# Altium schematic sheet USB.SchDoc
size A4; SheetNumber: 7; SheetTotal: 15
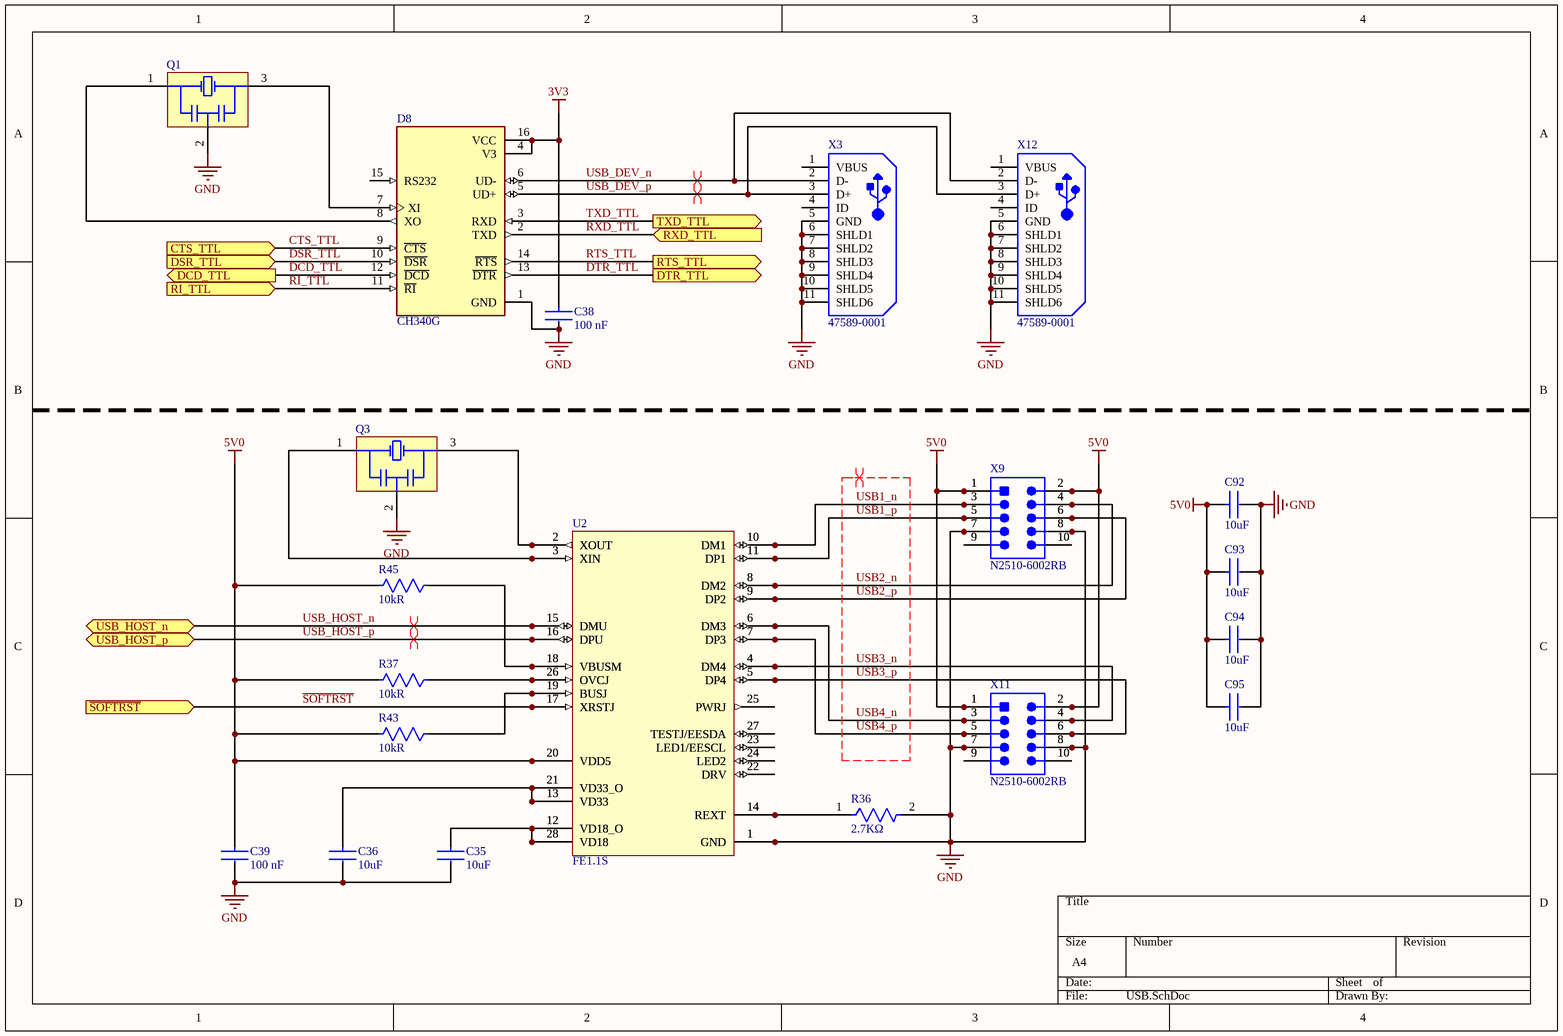
[diagram p0: USB.SchDoc]

## Parts
C35  Capacitance: 10uF  [FP-C0805C-DG-IPC_A]  (hidden comment: C0805C106K8PACTU)
C36  Capacitance: 10uF  [FP-C0805C-DG-IPC_A]  (hidden comment: C0805C106K8PACTU)
C38  Capacitance: 100 nF  [FP-CC0805-0_85-IPC_A]  (hidden comment: CC0805KRX7R9BB104)
C39  Capacitance: 100 nF  [FP-CC0805-0_85-IPC_A]  (hidden comment: CC0805KRX7R9BB104)
C92  Capacitance: 10uF  [FP-C0805C-DG-IPC_A]  (hidden comment: C0805C106K8PACTU)
C93  Capacitance: 10uF  [FP-C0805C-DG-IPC_A]  (hidden comment: C0805C106K8PACTU)
C94  Capacitance: 10uF  [FP-C0805C-DG-IPC_A]  (hidden comment: C0805C106K8PACTU)
C95  Capacitance: 10uF  [FP-C0805C-DG-IPC_A]  (hidden comment: C0805C106K8PACTU)
D8  CH340G  [SOIC127P600X180-16N]
Q1  CSTCE12M0G55Z-R0  [MURA-CSTCE_G_V]  (value not drawn)
Q3  CSTCE12M0G55Z-R0  [MURA-CSTCE_G_V]  (value not drawn)
R36  Resistance: 2.7KΩ  [FP-AC0805-IPC_A]  (hidden comment: AC0805FR-072K7L)
R37  Resistance: 10kR  [FP-CR0805-IPC_A]  (hidden comment: CR0805-JW-103ELF)
R43  Resistance: 10kR  [FP-CR0805-IPC_A]  (hidden comment: CR0805-JW-103ELF)
R45  Resistance: 10kR  [FP-CR0805-IPC_A]  (hidden comment: CR0805-JW-103ELF)
U2  FE1.1S  [TSOP64P600X160-28L]
X3  47589-0001  [MOLX-47589-0001_V]
X9  N2510-6002RB  [3M-N2510-6002-10_V]
X11  N2510-6002RB  [3M-N2510-6002-10_V]
X12  47589-0001  [MOLX-47589-0001_V]

## Ports
CTS_TTL (in), DCD_TTL (out), DSR_TTL (in), DTR_TTL (out), RI_TTL (in), RTS_TTL (out), RXD_TTL (in), TXD_TTL (out), USB_HOST_n (bidir), USB_HOST_p (bidir), ~{SOFTRST} (in)

## Nets
3V3: C38.1 D8.4(V3) D8.16(VCC)
5V0: C39.1 C92.1 C93.1 C94.1 C95.1 R37.2 R43.2 R45.2 U2.20(VDD5) X9.1 X9.2 X11.1 X11.2
GND: C35.2 C36.2 C38.2 C39.2 C92.2 C93.2 C94.2 C95.2 D8.1(GND) Q1.2(GND) Q3.2(GND) R36.2 U2.1(GND) X3.5(GND) X3.6(SHLD1) X3.7(SHLD2) X3.8(SHLD3) X3.9(SHLD4) X3.10(SHLD5) X3.11(SHLD6) X9.7 X9.8 X11.7 X11.8 X12.5(GND) X12.6(SHLD1) X12.7(SHLD2) X12.8(SHLD3) X12.9(SHLD4) X12.10(SHLD5) X12.11(SHLD6)
CTS_TTL: D8.9(~{CTS}) ; port CTS_TTL
DCD_TTL: D8.12(~{DCD}) ; port DCD_TTL
DSR_TTL: D8.10(~{DSR}) ; port DSR_TTL
DTR_TTL: D8.13(~{DTR}) ; port DTR_TTL
RI_TTL: D8.11(~{RI}) ; port RI_TTL
RTS_TTL: D8.14(~{RTS}) ; port RTS_TTL
RXD_TTL: D8.2(TXD) ; port RXD_TTL
~{SOFTRST}: U2.17(XRSTJ) ; port ~{SOFTRST}
TXD_TTL: D8.3(RXD) ; port TXD_TTL
USB1_n: U2.10(DM1) X9.3
USB1_p: U2.11(DP1) X9.5
USB2_n: U2.8(DM2) X9.4
USB2_p: U2.9(DP2) X9.6
USB3_n: U2.4(DM4) X11.4
USB3_p: U2.5(DP4) X11.6
USB4_n: U2.6(DM3) X11.3
USB4_p: U2.7(DP3) X11.5
USB_DEV_n: D8.6(UD-) X3.2(D-) X12.2(D-)
USB_DEV_p: D8.5(UD+) X3.3(D+) X12.3(D+)
USB_HOST_n: U2.15(DMU) ; port USB_HOST_n
USB_HOST_p: U2.16(DPU) ; port USB_HOST_p
NetC35_1: C35.1 U2.12(VD18_O) U2.28(VD18)
NetC36_1: C36.1 U2.13(VD33) U2.21(VD33_O)
NetD8_7: D8.7(XI) Q1.3(X2)
NetD8_8: D8.8(XO) Q1.1(X1)
NetQ3_1: Q3.1(X1) U2.3(XIN)
NetQ3_3: Q3.3(X2) U2.2(XOUT)
NetR36_1: R36.1 U2.14(REXT)
NetR37_1: R37.1 U2.26(OVCJ)
NetR43_1: R43.1 U2.19(BUSJ)
NetR45_1: R45.1 U2.18(VBUSM)

Not connected (* = marked no-connect by the designer): D8 15(RS232); U2 22(DRV) 23(LED1/EESCL) 24(LED2) 25(PWRJ) 27(TESTJ/EESDA); X3 1(VBUS) 4(ID); X9 9 10; X11 9 10; X12 1(VBUS) 4(ID)

## Layout directives
differential pair: USB1_n, USB1_p, USB2_n, USB2_p, USB3_n, USB3_p, USB4_n, USB4_p, USB_DEV_n, USB_DEV_p, USB_HOST_n, USB_HOST_p

## Library data of the parts
C35 C36 C92-C95 = CMP-2007-03243-2: CAP CER 10UF 10V X5R 0805; Manufacturer: KEMET; Manufacturer Part Number: C0805C106K8PACTU; Value: 10uF; Category: Cap; Case/Package: 0805
C38 C39 = CMP-2100-03606-3: CAP CER 0.1UF 50V X7R 0805; Manufacturer: Yageo; Value: 100 nF; Category: Cap; Manufacturer Part Number: CC0805KRX7R9BB104; Case/Package: 0805
D8 = CH340G: USB Interface Integrated Circuit; Value: CH340G; Case/Package: SOIC-16; Category: IC
Q1 Q3 = CMP-2000-06123-1: Ceramic Resonator, 12 MHz, +/- 0.5%, -40 to 125 degC, 3-Pin SMD, RoHS, Tape and Reel; Manufacturer: Murata; Capacitance: 33pF; Category: CrystalsandOscillators; Manufacturer Part Number: CSTCE12M0G55Z-R0; value: CSTCE12M0G55Z-R0
R36 = CMP-2001-04496-2: RES SMD 2.7K OHM 1% 1/8W 0805; Manufacturer: Yageo; Value: 2.7KΩ; Manufacturer Part Number: AC0805FR-072K7L; Category: Res; Case/Package: 0805
R37 R43 R45 = CMP-07231-003873-1: Thick Film Chip Resistors 0805 10kΩ 0.125W 5% 200ppm/°C; Manufacturer: Bourns; Number of Terminations: 2; Termination: SMD/SMT; Number of Pins: 2; Case/Package: 0805; Manufacturer Part Number: CR0805-JW-103ELF; value: 10kΩ; Category: Res
U2 = FE1.1S: USB 2.0 HIGH SPEED 4-PORT HUB CONTROLLER; Manufacturer: Terminus Technology Inc; value: FE1.1S; Case/Package: SSOP-28; Category: IC
X3 X12 = CMP-2000-05610-1: Right Angle Female Type AB Micro USB Connector, 30 V, 1.8 A, -30 to 85 degC, RoHS, Tape and Reel; Manufacturer: Molex; Manufacturer Part Number: 47589-0001; value: 47589-0001; Case/Package: Micro USB  (molex 47589-0001); Category: Connector
X9 X11 = CMP-2000-06794-1: Male Header, Pitch 2.54 mm, 2 x 5 Postion, Height 9.91 mm, Tail Length 2.84 mm, -55 to 105 degC, RoHS, Bulk; PartNumber: N2510; Manufacturer: 3M; Pitch: 2.54mm; value: 10-Pin Shrouded Header, 2.54mm; Manufacturer Part Number: N2510-6002RB; Case/Package: IDC-10; Category: Connector